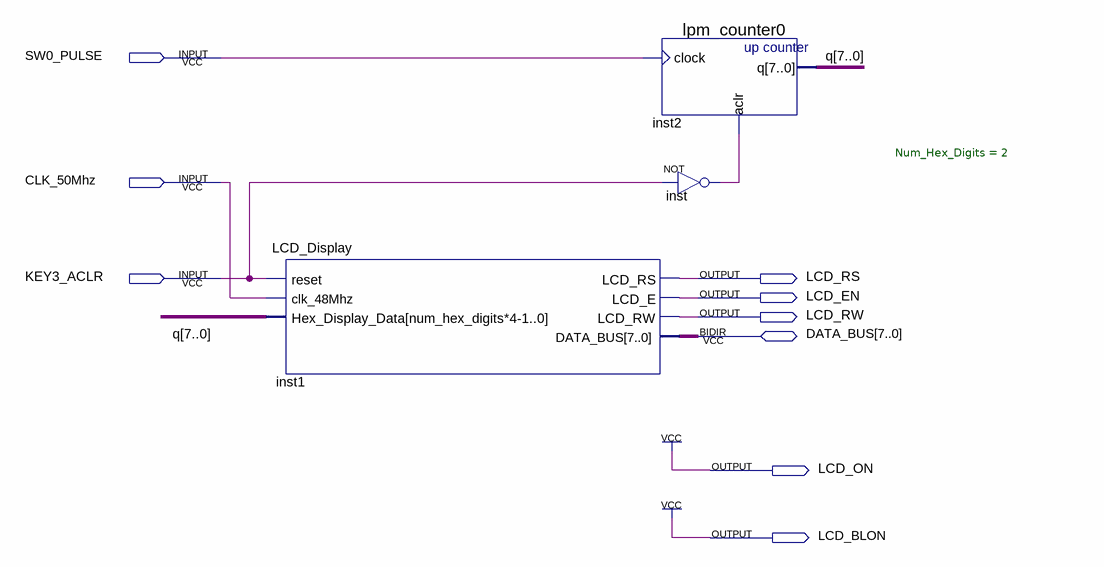
[diagram p0: schematic sheet]
// Quartus schematic tutor2.bdf as structural Verilog: 3 symbols, 9 pins
module tutor2 (
  input  SW0_PULSE,
  input  CLK_50Mhz,
  input  KEY3_ACLR,
  inout  [7:0] DATA_BUS,
  output LCD_RS,
  output LCD_EN,
  output LCD_RW,
  output LCD_ON,
  output LCD_BLON
);

  wire inst_out;
  wire [7:0] q;

  LCD_Display #(.Num_Hex_Digits(2)) inst1 (
    .reset(KEY3_ACLR), .clk_48Mhz(CLK_50Mhz), .Hex_Display_Data(q), .LCD_RS(LCD_RS), .LCD_E(LCD_EN),
    .LCD_RW(LCD_RW), .DATA_BUS(DATA_BUS));
  lpm_counter0 inst2 (.clock(SW0_PULSE), .aclr(inst_out), .q(q));
  not inst (inst_out, KEY3_ACLR);

  assign LCD_BLON = 1'b1;
  assign LCD_ON = 1'b1;
endmodule
